# EAGLE design HIJACK_LQPF_C (EAGLE 5.09)
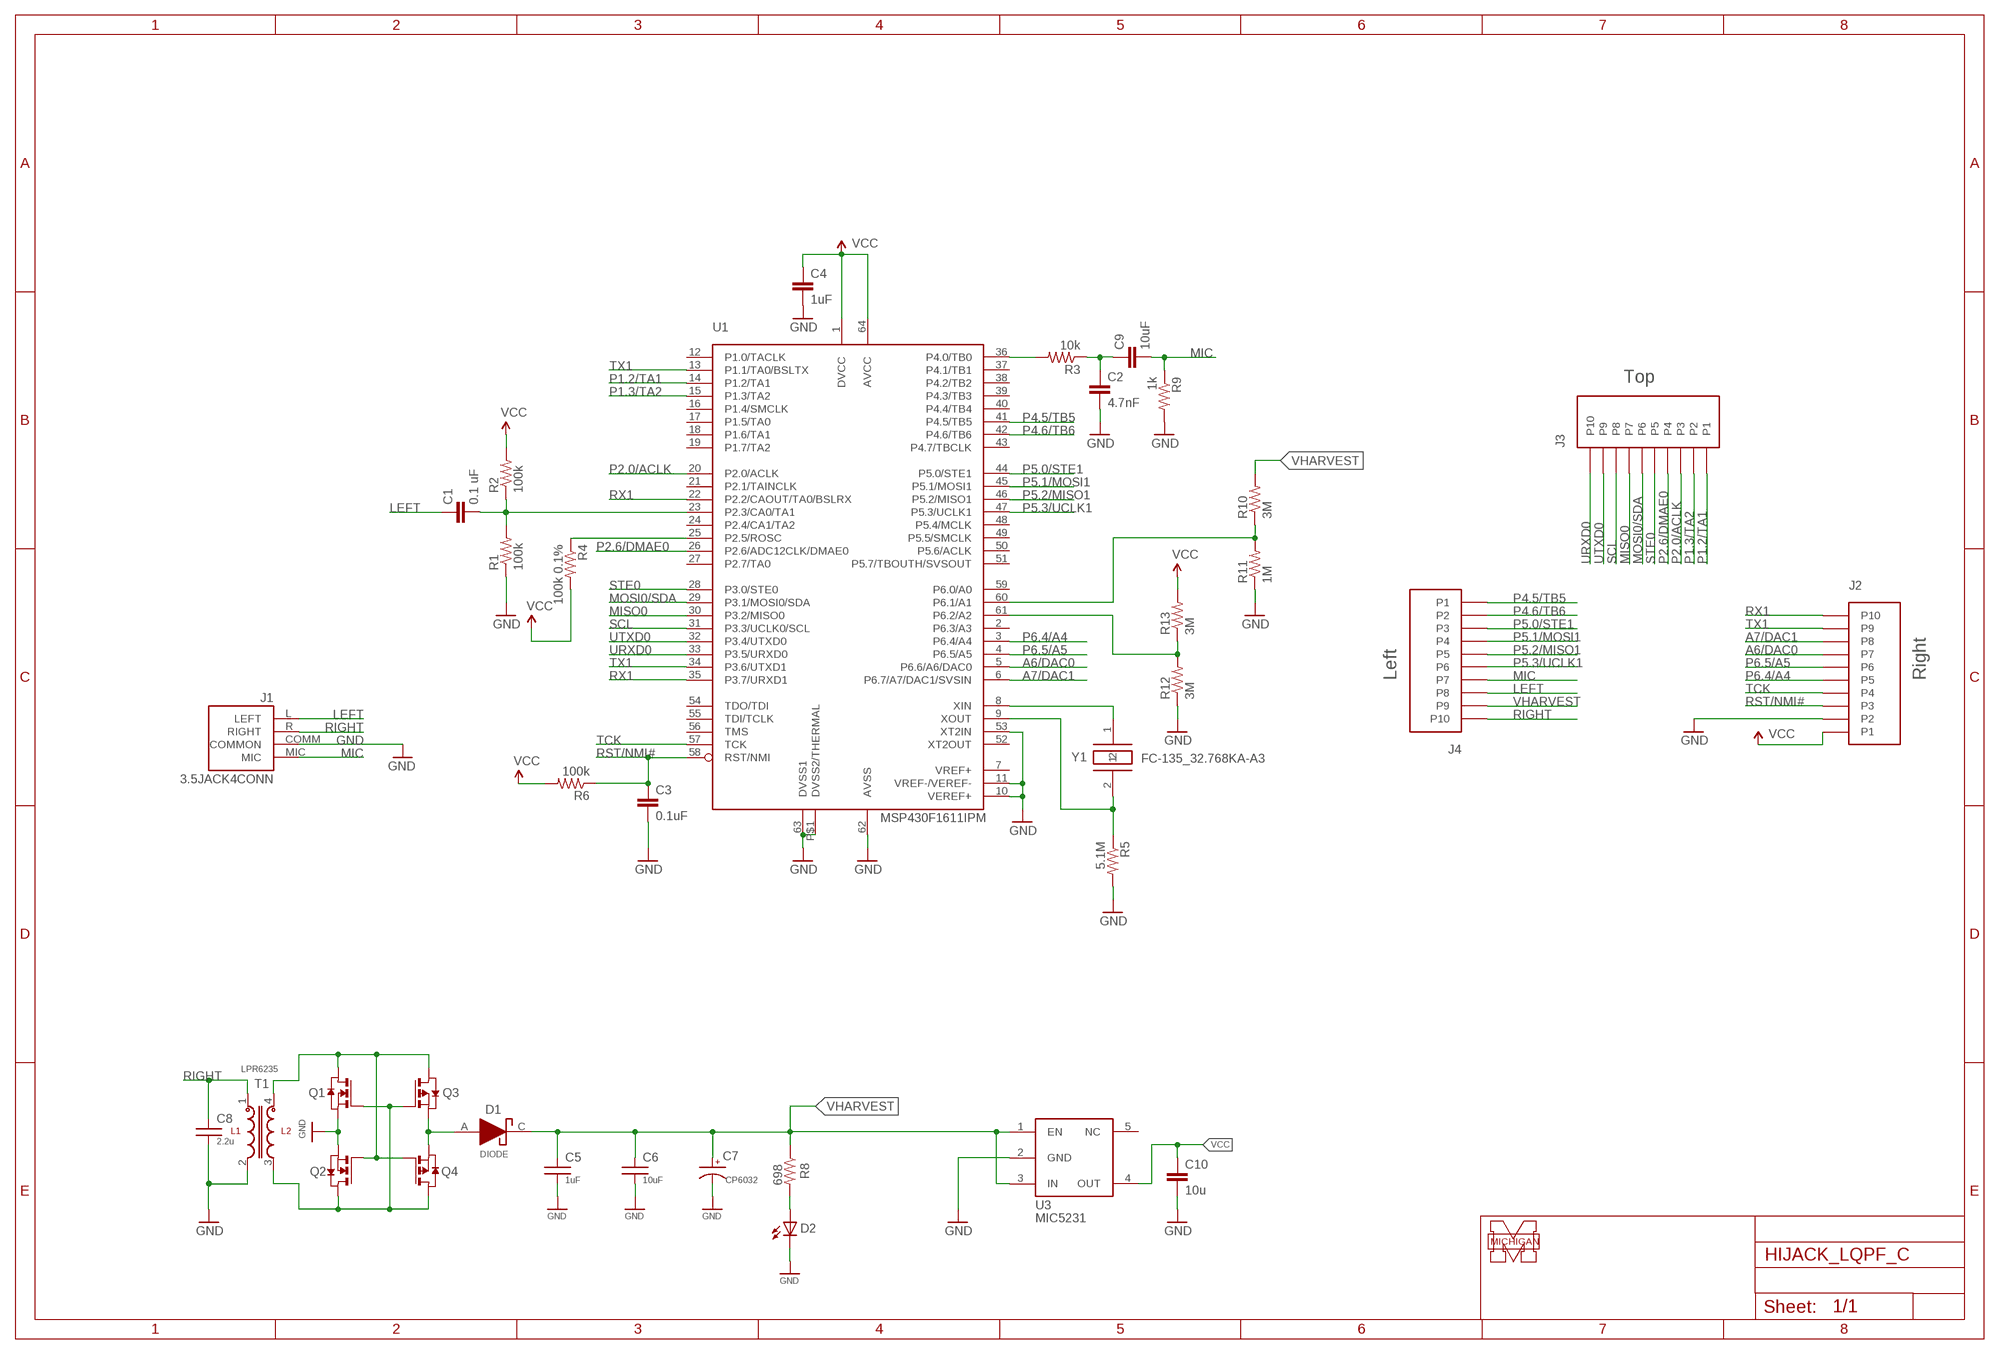
[diagram p0: schematic, sheet 1]

## Parts
C1  0.1 uF  CAP0603-CAP  [0603-CAP]
C2  4.7nF  CAP0603-CAP  [0603-CAP]
C3  0.1uF  CAP0603-CAP  [0603-CAP]
C4  1uF  CAP0603-CAP  [0603-CAP]
C5  1uF  C0603  [C0603]
C6  10uF  C0603  [C0603]
C7  CP6032  [CT6032]
C8  2.2u  C0603  [C0603]
C9  10uF  CAP0603-CAP  [0603-CAP]
C10  10u  C-EUC0603  [C0603]
D1  DIODE  [MINIMELF]
D2  LED0603  [LED-0603]
J1  3.5JACK4CONN  3.5JACK4CONNSUNSTONE_QUICKTURN  [PLUGBOARDCONNECTOR_SUNSTONE]
J2  HEADER10POS  [10PIN2MMHEADER]
J3  HEADER10POS  [10PIN2MMHEADER]
J4  HEADER10POS  [10PIN2MMHEADER]
Q1  NMOSSOT23  [SOT-23]
Q2  NMOSSOT23  [SOT-23]
Q3  PMOSSOT23  [SOT-23]
Q4  PMOSSOT23  [SOT-23]
R1  100k  RESISTOR0603-RES  [0603-RES]
R2  100k  RESISTOR0603-RES  [0603-RES]
R3  10k  RESISTOR0603-RES  [0603-RES]
R4  100k 0.1%  RESISTOR0603-RES  [0603-RES]
R5  5.1M  RESISTOR0603-RES  [0603-RES]
R6  100k  RESISTOR0603-RES  [0603-RES]
R8  698  R-US_R0603  [R0603]
R9  1k  RESISTOR0603-RES  [0603-RES]
R10  3M  RESISTOR0603-RES  [0603-RES]
R11  1M  RESISTOR0603-RES  [0603-RES]
R12  3M  RESISTOR0603-RES  [0603-RES]
R13  3M  RESISTOR0603-RES  [0603-RES]
T1  LPR6235  [LPR6235]
U1  MSP430F1611IPM  [PM/PAG64]
U3  MIC5231  [SOT23-5]
Y1  FC-135_32.768KA-A3  [FC-135]

## Nets
A6/DAC0: J2.P7 U1.5(P6.6/A6/DAC0)
A7/DAC1: J2.P8 U1.6(P6.7/A7/DAC1/SVSIN)
GND: C2.2 C3.2 C4.2 C5.2 C6.2 C7.- C8.2 C10.2 D2.C J1.COMM(COMMON) J2.P2 Q1.2(S) Q2.2(S) R1.1 R5.2 R9.2 R11.1 R12.1 T1.2 U1.10(VEREF+) U1.11(VREF-/VEREF-) U1.53(XT2IN) U1.62(AVSS) U1.63(DVSS1) U1.P$1(DVSS2/THERMAL) U3.2(GND)
LEFT: C1.1 J1.L(LEFT) J4.P8
MIC: C9.2 J1.MIC J4.P7 R9.1
MISO0: J3.P7 U1.30(P3.2/MISO0)
MOSI0/SDA: J3.P6 U1.29(P3.1/MOSI0/SDA)
N$1: C1.2 R1.2 R2.1 U1.23(P2.3/CA0/TA1)
N$2: R12.2 R13.1 U1.61(P6.2/A2)
N$3: R10.1 R11.2 U1.60(P6.1/A1)
N$4: R4.1 U1.25(P2.5/ROSC)
N$5: U1.8(XIN) Y1.1
N$7: R3.2 U1.36(P4.0/TB0)
N$8: Q1.1(D) Q2.3(G) Q3.1(D) Q4.3(G) T1.4
N$9: Q1.3(G) Q2.1(D) Q3.3(G) Q4.1(D) T1.3
N$10: R5.1 U1.9(XOUT) Y1.2
N$11: D2.A R8.2
N$12: C2.1 C9.1 R3.1
N$17: D1.A Q3.2(S) Q4.2(S)
P1.2/TA1: J3.P1 U1.14(P1.2/TA1)
P1.3/TA2: J3.P2 U1.15(P1.3/TA2)
P2.0/ACLK: J3.P3 U1.20(P2.0/ACLK)
P2.6/DMAE0: J3.P4 U1.26(P2.6/ADC12CLK/DMAE0)
P4.5/TB5: J4.P1 U1.41(P4.5/TB5)
P4.6/TB6: J4.P2 U1.42(P4.6/TB6)
P5.0/STE1: J4.P3 U1.44(P5.0/STE1)
P5.1/MOSI1: J4.P4 U1.45(P5.1/MOSI1)
P5.2/MISO1: J4.P5 U1.46(P5.2/MISO1)
P5.3/UCLK1: J4.P6 U1.47(P5.3/UCLK1)
P6.4/A4: J2.P5 U1.3(P6.4/A4)
P6.5/A5: J2.P6 U1.4(P6.5/A5)
RIGHT: C8.1 J1.R(RIGHT) J4.P10 T1.1
RST/NMI#: C3.1 J2.P3 R6.1 U1.58(RST/NMI)
RX1: J2.P10 U1.22(P2.2/CAOUT/TA0/BSLRX) U1.35(P3.7/URXD1)
SCL: J3.P8 U1.31(P3.3/UCLK0/SCL)
STE0: J3.P5 U1.28(P3.0/STE0)
TCK: J2.P4 U1.57(TCK)
TX1: J2.P9 U1.13(P1.1/TA0/BSLTX) U1.34(P3.6/UTXD1)
URXD0: J3.P10 U1.33(P3.5/URXD0)
UTXD0: J3.P9 U1.32(P3.4/UTXD0)
VCC: C4.1 C10.1 J2.P1 R2.2 R4.2 R6.2 R13.2 U1.1(DVCC) U1.64(AVCC) U3.4(OUT)
VHARVEST: C5.1 C6.1 C7.+ D1.C J4.P9 R8.1 R10.2 U3.1(EN) U3.3(IN)
Unconnected: U1.2(P6.3/A3) U1.7(VREF+) U1.12(P1.0/TACLK) U1.16(P1.4/SMCLK) U1.17(P1.5/TA0) U1.18(P1.6/TA1) U1.19(P1.7/TA2) U1.21(P2.1/TAINCLK) U1.24(P2.4/CA1/TA2) U1.27(P2.7/TA0) U1.37(P4.1/TB1) U1.38(P4.2/TB2) U1.39(P4.3/TB3) U1.40(P4.4/TB4) U1.43(P4.7/TBCLK) U1.48(P5.4/MCLK) U1.49(P5.5/SMCLK) U1.50(P5.6/ACLK) U1.51(P5.7/TBOUTH/SVSOUT) U1.52(XT2OUT) U1.54(TDO/TDI) U1.55(TDI/TCLK) U1.56(TMS) U1.59(P6.0/A0) U3.5(NC)

## Notes on the sheet
- Top
- Left | Right
- MICHIGAN

## Library data of the parts
C1-C4 C9 = SparkFun:CAP: Capacitor Standard 0603 ceramic capacitor, and 0.1" leaded capacitor.
C5 C6 C8 = umich:C
C7 = umich:CP
C10 = rcl:C-EU: CAPACITOR, European symbol
D1 = umich:DIODE
D2 = umich:LED: LEDs Standard schematic elements and footprints for 5mm, 3mm, 1206, and 0603 sized LEDs. 5mm - Spark Fun Electronics SKU : COM-00529 (and others)
J1 = Thomas:3.5JACK4CONN
J2-J4 = Thomas:HEADER10POS: Fits 3M 950510-6102-AR
Q1 Q2 = zetex:NMOSSOT23: MOS FET
Q3 Q4 = zetex:PMOSSOT23: MOS FET
R1-R6 R9-R13 = SparkFun:RESISTOR: Resistor Basic schematic elements and footprints for 0603, 1206, and PTH 1/10th watt (small) resistors.
R8 = rcl:R-US_: RESISTOR, American symbol
T1 = umich:LPR6235
U1 = Thomas:MSP430F1611
U3 = berkeley-epic:MIC5231
Y1 = berkeley-epic:FC-135_32.768KA-A3

## Board
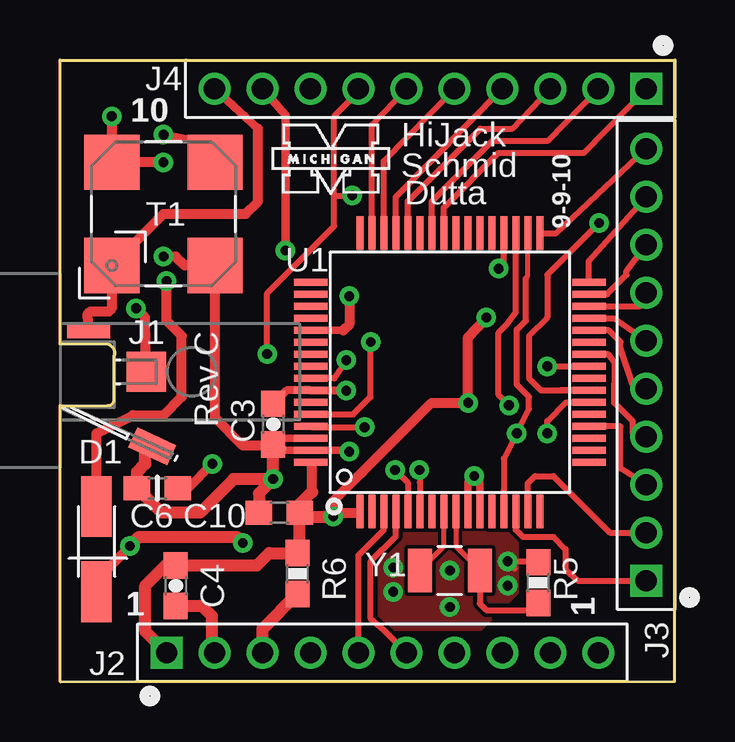
[diagram p1: board, top side]
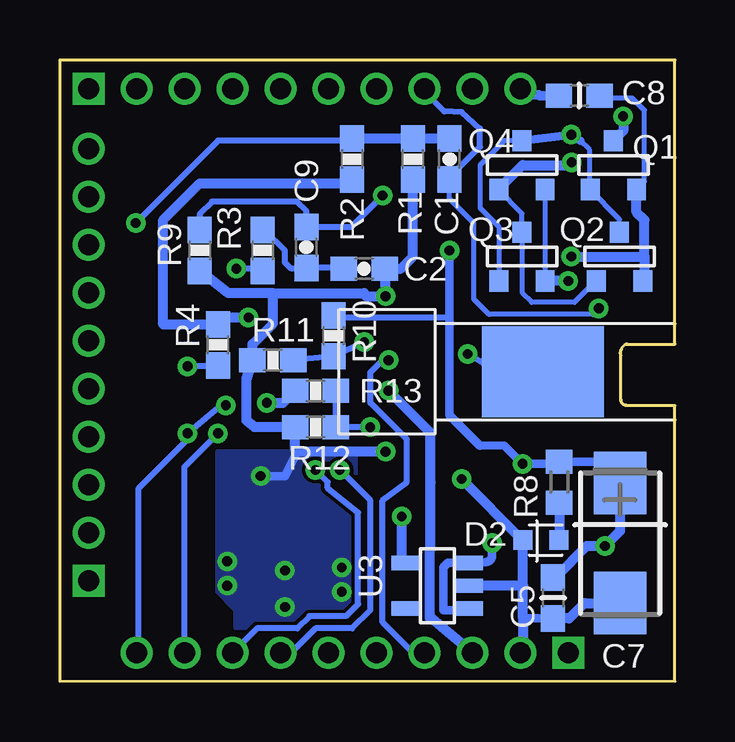
[diagram p2: board, bottom side, seen from below]

Size 25.64 x 25.9 mm. Coordinates in mm from the lower left corner, seen from the top.
Outline: 0,10.93 0,0 25.63,0.01 25.64,25.9 0,25.9 0,14.92
Copper layers (1*16): Top 0.0178mm / dielectric 1.4986mm / Bottom 0.0178mm
Design rules "SSC-EAGLE-2Lyr_v1.0.0.3 *": minimum track width 6mil, minimum drill 14mil, track to track 6mil, track to pad 6mil, pad to pad 6mil, via to via 6mil, smd to smd 6mil, copper to edge 20mil, drill to drill 16mil, minimum pad ring 8mil, minimum via ring 8mil, stop-mask expansion 3mil, vias tented up to drill 16mil, thermal gap 10mil

### Footprints (pad centres in the part's own frame; a part is rotated, then mirrored left to right if it is on the bottom)
0603-CAP = smd 1.1 x 1: 1 -0.85,0; 2 0.85,0
C0603 = smd 1.1 x 1: 1 -0.85,0; 2 0.85,0
CT6032 = smd 2.6 x 2.2: + -2.5,0; - 2.5,0
MINIMELF = smd 2.54 x 1.27: A -1.778,0; C 1.778,0
LED-0603 = smd 0.8 x 0.8: A 0,-0.75; C 0,0.75
PLUGBOARDCONNECTOR_SUNSTONE = smd 1.778 x 0.914 rotated 155: COMM 3.799,-3.103 | smd 1.651 x 1.651: L 3.55,0 | smd 5.08 x 3.81 bottom: MIC 5.45,0 | smd 1.778 x 0.635: R 1.15,1.706
10PIN2MMHEADER = drill 0.89 pad 1.346 square: P1 0,0 | drill 0.89 pad 1.346 round: P2 2,0; P3 4,0; P4 6,0; P5 8,0; P6 10,0; P7 12,0; P8 14,0; P9 16,0; P10 18,0
SOT-23 = smd 0.787 x 0.889: 1 0.025,-1.016; 2 -0.94,1.016; 3 0.991,1.016
0603-RES = smd 1.1 x 1: 1 -0.85,0; 2 0.85,0
R0603 = smd 1 x 1.1: 1 -0.85,0; 2 0.85,0
LPR6235 = smd 2.3 x 2.3: 1 -2.15,2.15; 2 -2.15,-2.15; 3 2.15,-2.15; 4 2.15,2.15
PM/PAG64 = smd 1.4 x 0.3: 1 -5.8,3.75; 2 -5.8,3.25; 3 -5.8,2.75; 4 -5.8,2.25; 5 -5.8,1.75; 6 -5.8,1.25; 7 -5.8,0.75; 8 -5.8,0.25; 9 -5.8,-0.25; 10 -5.8,-0.75; 11 -5.8,-1.25; 12 -5.8,-1.75; 13 -5.8,-2.25; 14 -5.8,-2.75; 15 -5.8,-3.25; 16 -5.8,-3.75; 33 5.8,-3.75; 34 5.8,-3.25; 35 5.8,-2.75; 36 5.8,-2.25; 37 5.8,-1.75; 38 5.8,-1.25; 39 5.8,-0.75; 40 5.8,-0.25; 41 5.8,0.25; 42 5.8,0.75; 43 5.8,1.25; 44 5.8,1.75; 45 5.8,2.25; 46 5.8,2.75; 47 5.8,3.25; 48 5.8,3.75 | smd 0.3 x 1.4: 17 -3.75,-5.8; 18 -3.25,-5.8; 19 -2.75,-5.8; 20 -2.25,-5.8; 21 -1.75,-5.8; 22 -1.25,-5.8; 23 -0.75,-5.8; 24 -0.25,-5.8; 25 0.25,-5.8; 26 0.75,-5.8; 27 1.25,-5.8; 28 1.75,-5.8; 29 2.25,-5.8; 30 2.75,-5.8; 31 3.25,-5.8; 32 3.75,-5.8; 49 3.75,5.8; 50 3.25,5.8; 51 2.75,5.8; 52 2.25,5.8; 53 1.75,5.8; 54 1.25,5.8; 55 0.75,5.8; 56 0.25,5.8; 57 -0.25,5.8; 58 -0.75,5.8; 59 -1.25,5.8; 60 -1.75,5.8; 61 -2.25,5.8; 62 -2.75,5.8; 63 -3.25,5.8; 64 -3.75,5.8 | smd 0.152 x 0.305: P$1 -3.175,6.985
SOT23-5 = smd 0.6 x 1.2: 1 -0.95,-1.306; 2 0,-1.306; 3 0.95,-1.306; 4 0.95,1.306; 5 -0.95,1.306
FC-135 = smd 1 x 1.8: 1 -1.25,0; 2 1.25,0

### Placement (x,y rotation side)
C1  9.4,21.78 90 bottom
C2  12.95,17.21 0 bottom
C3  8.89,10.73 270 top
C4  4.83,4 270 top
C5  5.08,3.49 270 bottom
C6  4.06,8.06 180 top
C7  2.29,5.78 270 bottom
C8  3.99,24.42 0 bottom
C9  15.37,18.09 90 bottom
C10  9.14,7.05 180 top
D1  1.52,5.52 270 top
D2  5.59,5.9 90 bottom
J1  0.05,12.91 0 top
J2  4.45,1.2 0 top
J3  24.44,4.2 90 top
J4  24.44,24.7 180 top
Q1  2.54,21.52 180 bottom
Q2  2.29,17.71 180 bottom
Q3  6.35,17.71 180 bottom
Q4  6.35,21.52 180 bottom
R1  10.92,21.78 90 bottom
R2  13.46,21.78 270 bottom
R3  17.2,17.97 270 bottom
R4  19.05,14.03 90 bottom
R5  19.94,4.12 90 top
R6  9.91,4.51 90 top
R8  4.83,8.32 270 bottom
R9  19.81,17.97 270 bottom
R10  14.22,14.41 90 bottom
R11  16.76,13.4 0 bottom
R12  14.99,10.6 0 bottom
R13  14.99,12.13 180 bottom
T1  4.32,19.49 90 top
U1  16.26,12.89 90 top
U3  9.91,4 90 bottom
U$2  [UMICH]  8.76,20.13 0 top
Y1  16.26,4.63 0 top

### Tracks (layer width: path | path; a pad name or v marks a point on that pad's centre or on a via)
A6/DAC0  (via drill 0.41)
  Top 0.254: U1.5 14.51,8.29 v13.97,8.82
  Bottom 0.254: J2.P7 16.3,1.2 16.02,1.18 14.99,2.22 13.46,2.22 12.7,2.98 12.7,7.55 v13.97,8.82
A7/DAC1  (via drill 0.41)
  Top 0.254: U1.6 15.01,8.29 v14.99,8.82
  Bottom 0.254: J2.P8 17.43,2.22 15.75,2.22 15.24,2.73 13.72,2.73 13.21,3.23 13.21,7.04 14.48,8.06 14.48,8.31 v14.99,8.82
GND  (via drill 0.41)
  Top 0.203: C3.2 9.15,10.14 | U1.11 17.53,7.09
  Top 0.254: 18.96,4.72 v18.67,5.01 19.9,5.01 R5.2 | C3.2 8.85,9.84 | J2.P2 6.35,1.3
  Top 0.305: 9.15,10.14 U1.62 | 11.81,14.64 U1.53 | v12.06,9.58 12.01,9.64 U1.63 9.27,9.64 U1.P$1 9.06,9.71 C3.2 | U1.10 17.01,8.3 v17.27,8.57 17.51,8.33 U1.11
  Top 0.406: v4.32,17.71 4.83,17.71 5.2,17.34 T1.2 6.47,10.99 7.62,9.84 8.85,9.84 | 3.56,9.54 J1.COMM | 11.81,14.64 12.06,14.89 v12.06,16.06
  Top 0.508: 3.56,9.54 3.56,9.08 3.21,8.73 C6.2 4.23,7.04 5.84,7.04 7.24,8.44 v8.89,8.44 | v8.89,8.44 C3.2 | J2.P2 6.34,1.31 6.34,2.73 5.92,3.15 C4.2 | v8.89,8.44 8.29,7.85 C10.2
  Bottom 0.203: 1.27,16.7 Q2.2 | 6.35,5.9 6.35,6.03 6.34,6.02 D2.C | Q1.2 1.27,20.84 1.27,23.81 1.78,24.32 2.67,24.32
  Bottom 0.254: 12.06,17.17 C2.2 | 15.75,9.58 15.84,9.67 | 6.34,1.31 J2.P2 | 2.67,24.32 3.14,24.32 C8.2
  Bottom 0.356: 15.75,9.58 16.26,8.57 v17.27,8.57 | C5.2 6.34,2.64
  Bottom 0.406: Q1.2 1.6,19.57 1.27,19.24 1.27,17.71 | 1.27,17.71 1.27,16.7 | C5.2 4.41,2.64 3.77,3.27 C7.- | Q2.2 1.35,16.77 | v4.32,17.71 1.27,17.71 | 6.35,5.9 v8.89,8.44 | v12.06,9.58 15.75,9.58 | 6.34,4 6.34,2.64 6.34,1.31 | 6.34,4 D2.C | 6.34,4 U3.2 | 12.06,17.17 v12.06,16.06 12.83,16.06 arc90 12.95,16.19 16.76,16.19 | R9.2 18.63,16.19 16.76,16.19 | 15.84,9.67 R12.1 17.53,10.6 17.86,10.88 17.87,10.89 17.87,12.59 R11.1 17.61,14.07 16.76,14.92 16.76,16.19 | C2.2 11.43,17.2 10.92,17.71 R1.1
  other vias: 16.26,4.63 18.67,4 16.26,3.11 13.89,4.76 13.89,3.74
  pour Bottom: 13.33,9.59 13.33,2.47 18.29,2.22 18.29,2.98 19.05,3.74 19.05,9.59
  pour Top (no thermals): 19.05,6.16 13.33,6.16 13.33,2.22 17.53,2.22 19.05,3.74
LEFT  (via drill 0.41)
  Top 0.406: J1.L 3.55,15.18 v3.17,15.55
  Bottom 0.203: v3.17,15.55 3.43,15.3 7.75,15.3 8.38,15.93 8.38,19.11 9.4,20.13 C1.1
  Bottom 0.254: C1.1 9.4,21.02 8.13,22.29 8.13,23.05 8.89,23.73 9.63,23.76 10.41,24.56 J4.P8
MIC  (via drill 0.41)
  Top 0.254: v8.64,13.65 8.64,16.19 11.43,18.98 11.43,20.25 | 11.43,20.25 11.43,23.55 12.41,24.53 J4.P7 | 11.43,20.25 v12.19,20.25
  Bottom 0.254: J1.MIC 7.39,12.91 v8.64,13.65 | R9.1 19.81,19.49 19.3,20 15.75,20 15.37,19.62 C9.2 13.5,18.94 v12.19,20.25
MISO0
  Top 0.254: U1.30 24.15,15.64 J3.P7
MOSI0/SDA
  Top 0.254: U1.29 23.12,15.14 J3.P6
N$1  (via drill 0.41)
  Top 0.254: 20.84,12.14 U1.23 20.05,12.14 19.56,12.63 19.56,14.41 20.32,15.17 20.32,16.95 v22.48,19.11
  Bottom 0.254: R2.1 13.3,22.54 19.05,22.54 v22.48,19.11 22.61,18.98
  Bottom 0.406: C1.2 R1.2 R2.1
N$2  (via drill 0.41)
  Top 0.254: v12.7,10.6 10.49,10.6 U1.61
  Bottom 0.254: R13.1 R12.2 v12.7,10.6
N$3  (via drill 0.41)
  Top 0.254: U1.60 12.22,11.14 12.95,11.87 v12.95,14.16
  Bottom 0.254: v12.95,14.16 R10.1 R11.2
N$4  (via drill 0.41)
  Top 0.254: v20.32,13.14 U1.25
  Bottom 0.254: R4.1 19.34,13.14 v20.32,13.14
N$5
  Top 0.203: U1.8 16.01,5.63 Y1.1
N$7  (via drill 0.41)
  Top 0.254: v18.29,17.2 18.51,17.42 U1.36
  Bottom 0.254: R3.2 17.36,17.2 v18.29,17.2
N$8  (via drill 0.41)
  Top 0.406: v2.16,23.55 2.17,23.42 T1.4 v4.31,21.64
  Bottom 0.203: Q4.3 7.37,20.51 6.38,19.52 Q3.1 6.35,18.73 6.35,16.19 5.97,15.81 4.19,15.81 3.3,16.7 Q2.3
  Bottom 0.406: v2.16,23.55 2.16,22.95 Q1.1 | Q4.3 7.34,20.53 6.35,21.52 4.44,21.52 v4.31,21.64
N$9  (via drill 0.41)
  Top 0.356: v4.32,22.79 5.57,22.54 arc-90 T1.3
  Bottom 0.203: 3.56,20.51 Q1.3 | Q2.1 2.31,19.26 3.56,20.51 | Q3.3 7.34,18.96 8.13,19.75 8.13,21.52 7.11,22.54 Q4.1 | 3.94,22.54 3.56,22.16 3.56,20.51
  Bottom 0.356: 3.94,22.54 v4.32,22.79 Q4.1
N$10
  Top 0.203: U1.9 16.51,5.63 Y1.2
  Top 0.254: Y1.2 17.51,3.25 17.78,2.98 19.9,2.98 R5.1
N$11
  Bottom 0.406: D2.A 4.84,6.02 4.83,6.54 R8.2
N$12
  Bottom 0.254: C2.1 13.84,17.24 C9.1 15.41,17.2 16,17.2 16.26,17.46 16.26,17.97 17.11,18.82 R3.1
N$17  (via drill 0.41)
  Top 0.406: D1.A 1.52,10.35 3.05,11.11 4.32,11.11 5.08,11.87 5.08,14.41 4.44,15.05 v4.44,16.7
  Bottom 0.203: Q3.2 Q4.2 5.41,20.56 5.33,20.63
  Bottom 0.406: v4.44,16.7 Q3.2
P1.2/TA1
  Top 0.254: U1.14 19.01,6.33 19.3,6.03 20.57,6.03 21.08,5.52 21.08,4.67 21.59,4.21 24.26,4.21 J3.P1
P1.3/TA2
  Top 0.254: U1.15 19.51,8.26 19.81,8.57 20.57,8.57 22.93,6.21 J3.P2
P2.0/ACLK
  Top 0.254: U1.20 23.37,10.64 23.37,8.89 J3.P3
P2.6/DMAE0
  Top 0.254: U1.26 22.87,13.64 23.14,13.29 23.11,11.62 23.88,10.85 23.88,10.38 J3.P4
P4.5/TB5
  Top 0.254: U1.41 16.01,19.75 18.29,22.03 21.84,22.03 J4.P1
P4.6/TB6
  Top 0.254: U1.42 15.51,20.01 18.03,22.54 20.35,22.54 J4.P2
P5.0/STE1
  Top 0.254: U1.44 14.51,20.03 17.53,23.05 18.86,23.05 J4.P3
P5.1/MOSI1
  Top 0.254: U1.45 14.01,20.2 J4.P4
P5.2/MISO1
  Top 0.254: U1.46 13.51,21.7 J4.P5
P5.3/UCLK1
  Top 0.254: U1.47 13.01,23.2 J4.P6
P6.4/A4
  Top 0.254: U1.3 13.51,6.33 12.45,5.27 J2.P5
P6.5/A5
  Top 0.254: U1.4 14.01,6.07 12.95,5.01 12.95,2.63 13.53,2.12 J2.P6
RIGHT
  Top 0.356: 8.25,23.05 J4.P10
  Top 0.406: J1.R 1.15,15.31 1.27,15.43 2.03,15.43 2.17,15.56 T1.1 4.32,19.49 7.75,19.49 8.25,20 8.25,23.05
  Bottom 0.356: 5.68,24.44 6.26,24.44 J4.P10
  Bottom 0.406: 5.68,24.44 C8.1
RST/NMI#  (via drill 0.41)
  Top 0.254: 10.47,12.12 U1.58
  Top 0.33: C3.1 9.45,12.14 U1.58 | v11.94,12.12 10.47,12.12
  Top 0.508: R6.1 8.44,2.19 J2.P3
  Bottom 0.254: 10.11,2.61 10.21,2.61
  Bottom 0.406: 10.21,2.61 10.19,8.29 10.19,10.37 v11.94,12.12 | J2.P3 10.11,2.61
RX1  (via drill 0.41)
  Top 0.254: U1.22 21.1,11.64 20.32,10.85 v20.32,10.35 | U1.35 19.01,15.38 18.64,14.89 18.29,14.54 18.29,11.95 v18.72,11.51
  Bottom 0.254: v18.72,11.51 18.8,11.62 v20.32,10.35 20.32,10.09 22.35,8.06 22.35,1.23 22.42,1.23 J2.P10
SCL
  Top 0.254: U1.31 22.81,16.14 23.62,16.95 23.62,17.11 J3.P8
STE0
  Top 0.254: U1.28 22.89,14.64 23.37,14.16 23.37,13.9 23.88,12.38 J3.P5
TCK  (via drill 0.41)
  Top 0.254: v11.94,13.39 11.43,12.64 U1.57
  Bottom 0.254: v11.94,13.39 12.19,13.39 12.7,12.89 12.7,11.62 11.18,10.09 11.18,8.31 12.19,7.55 12.19,2.47 10.9,1.18 10.47,1.18 J2.P4
TX1  (via drill 0.41)
  Top 0.203: U1.34 19.51,16.9 19.43,16.82 | 18.51,7.97 U1.13
  Top 0.254: 19.43,16.82 19.43,15.05 19.05,14.66 19.05,12.38 19.56,11.87 19.56,11.36 v19.05,10.35 18.51,9.29 18.51,7.97
  Bottom 0.254: J2.P9 20.44,8.95 v19.05,10.35
URXD0
  Top 0.254: U1.33 20.69,18.69 J3.P10
UTXD0
  Top 0.254: U1.32 22.06,17.54 J3.P9
VCC  (via drill 0.41)
  Top 0.203: 10.52,9.08 U1.64
  Top 0.305: 12.46,7.04 U1.1
  Top 0.33: 12.51,8.64 12.57,8.7
  Top 0.356: v11.39,6.88 11.56,7.04
  Top 0.406: 10.52,7.91 10.52,9.08 | 11.56,7.04 12.46,7.04 | v17.78,15.17 17.02,14.36 v17.02,11.62 15.49,11.62 12.57,8.7 | 12.51,8.64 11.39,7.52 v11.39,6.88
  Top 0.508: J2.P1 3.56,2.09 3.56,4 4.41,4.85 C4.1 8.22,4.85 8.72,5.36 R6.2 9.99,5.44 C10.1 | C10.1 10.16,6.88 v11.39,6.88 | 10.52,7.91 9.99,7.39 C10.1
  Bottom 0.254: 18.76,15.17 R4.2 | 13.37,20.76 R2.2
  Bottom 0.356: 11.39,5.13 U3.4
  Bottom 0.406: v11.39,6.88 11.39,5.13 | v17.78,15.17 18.76,15.17 | v17.02,11.62 16.34,11.62 R13.2 | R4.2 21.34,14.88 21.34,19.24 19.81,20.76 13.37,20.76
VHARVEST  (via drill 0.41, 0.41 pad 0.81)
  Top 0.203: 5.33,8.06 C6.1
  Top 0.356: v6.35,9.08 5.33,8.06 | v9.4,17.97 9.4,23.61 J4.P9
  Top 0.406: v2.92,5.65 1.52,4.25 D1.C
  Top 0.508: 2.92,5.62 v2.92,5.65 3.3,6.03 7.37,6.03 v7.62,5.78
  Bottom 0.254: C7.+ 3.18,9.16 | R8.1 4.91,9.08 | R10.2 14.14,15.17 9.4,15.17
  Bottom 0.33: 8.13,9.84 7.11,9.84 v6.35,9.08
  Bottom 0.356: 4.91,9.08 v6.35,9.08 | U3.1 8.67,2.98 9.65,2.98 9.65,4.76 9.46,4.95 U3.3 7.89,4.99 arc-90 7.62,5.25 v7.62,5.78 | 3.18,9.16 R8.1 | v9.4,17.97 9.4,15.17 9.4,11.11 8.13,9.84
  Bottom 0.406: 4.95,4.38 3.68,5.65 v2.92,5.65 2.29,6.28 C7.+
  Bottom 0.508: 4.95,4.38 4.99,4.34 C5.1

### Text on the board
tPlace: HiJack | Schmid | Dutta | Rev C
tNames: 10 | 9-9-10 | 1 | 1 | 1